# EAGLE design mSD-Shield_v11 (EAGLE 5.11)
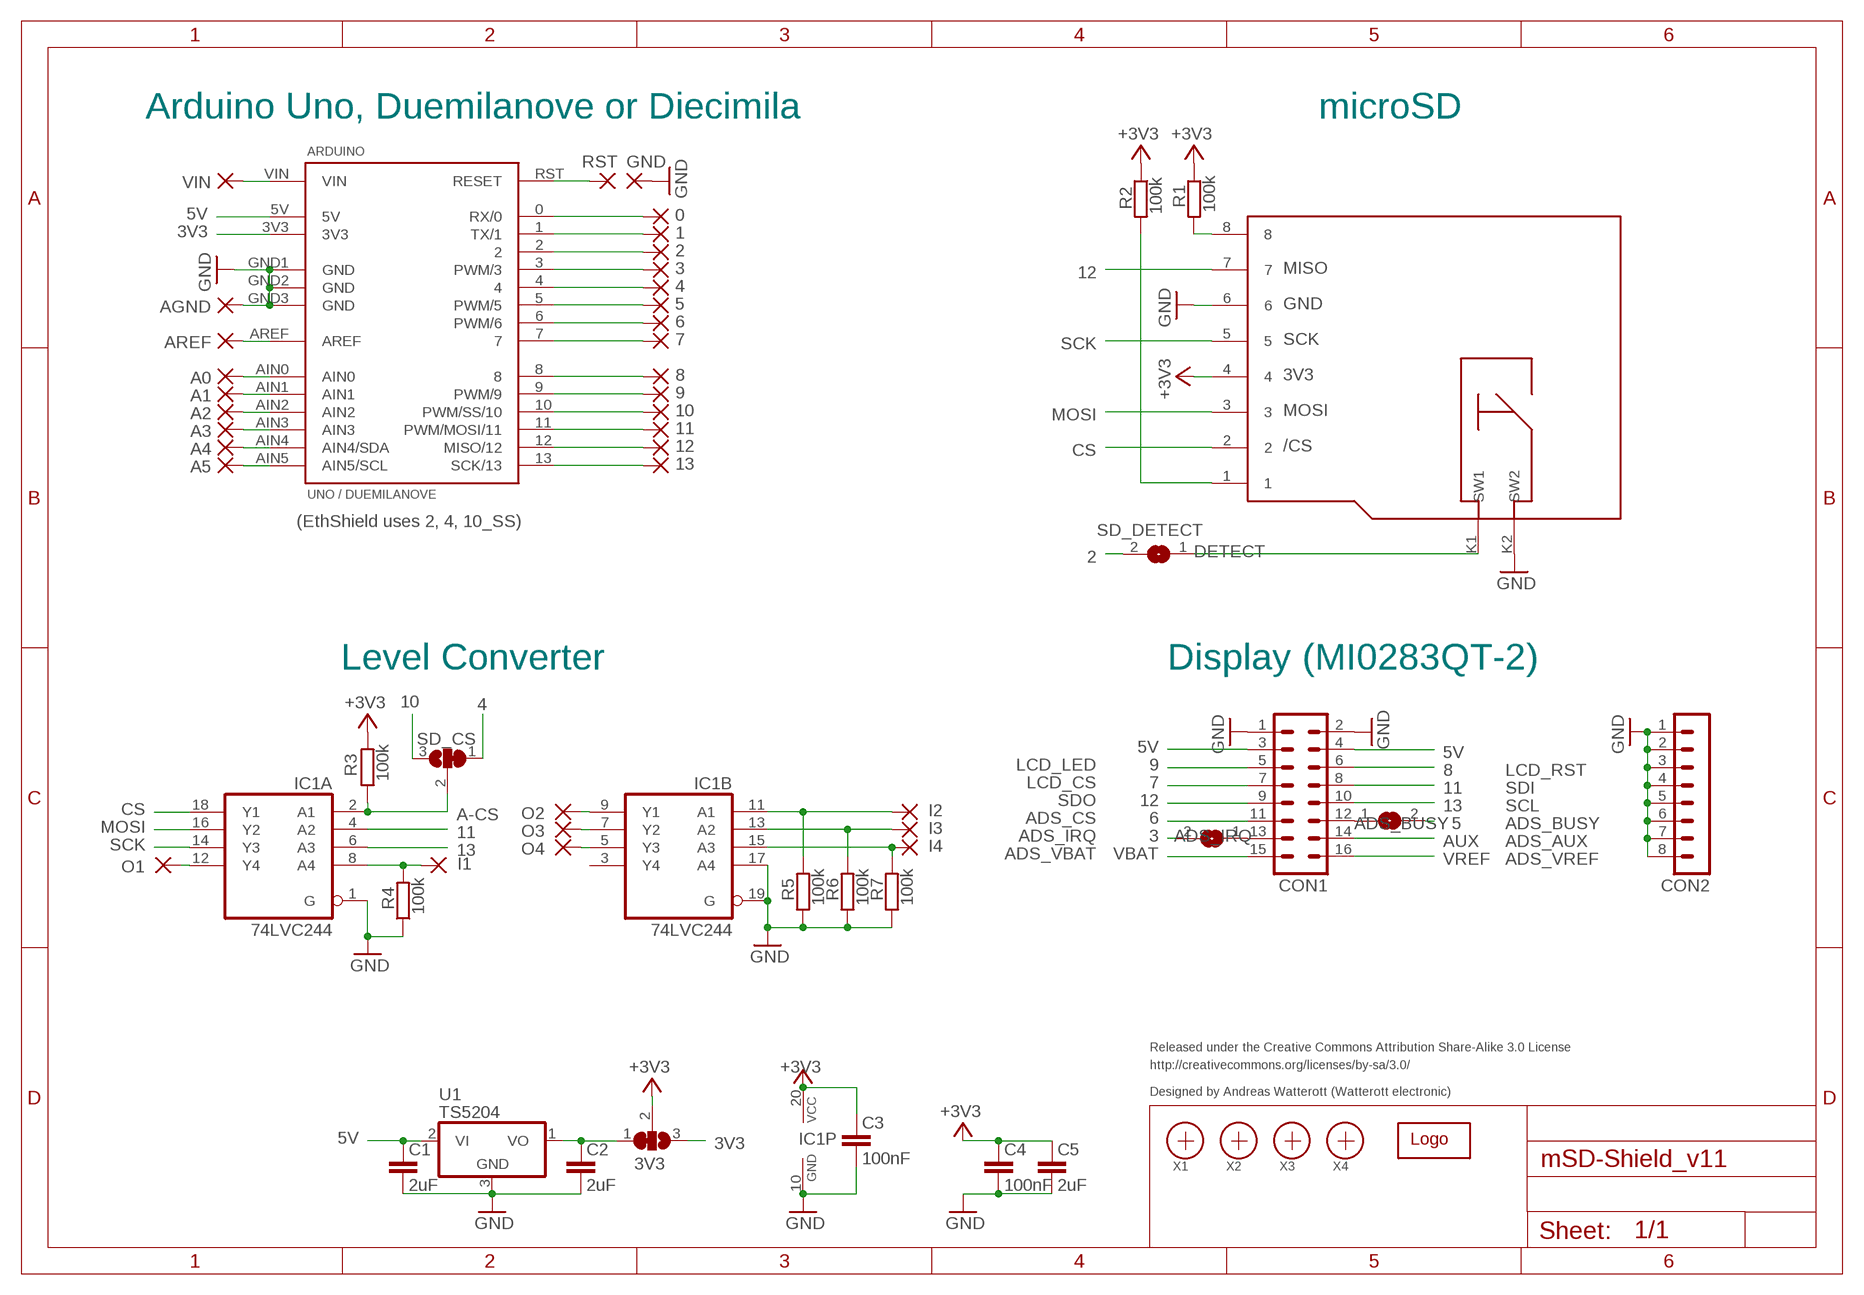
[diagram p0: schematic, sheet 1]

## Parts
0  1,6/0,8  [1,6/0,8]
1  1,6/0,8  [1,6/0,8]
2  1,6/0,8  [1,6/0,8]
3  1,6/0,8  [1,6/0,8]
3V3  SJ2W  [SJ_2]
4  1,6/0,8  [1,6/0,8]
5  1,6/0,8  [1,6/0,8]
6  1,6/0,8  [1,6/0,8]
7  1,6/0,8  [1,6/0,8]
8  1,6/0,8  [1,6/0,8]
9  1,6/0,8  [1,6/0,8]
10  1,6/0,8  [1,6/0,8]
11  1,6/0,8  [1,6/0,8]
12  1,6/0,8  [1,6/0,8]
13  1,6/0,8  [1,6/0,8]
A0  1,6/0,8  [1,6/0,8]
A1  1,6/0,8  [1,6/0,8]
A2  1,6/0,8  [1,6/0,8]
A3  1,6/0,8  [1,6/0,8]
A4  1,6/0,8  [1,6/0,8]
A5  1,6/0,8  [1,6/0,8]
ADS_BUSY  SJ  [SJ]
ADS_IRQ  SJ  [SJ]
AGND  1,6/0,8  [1,6/0,8]
ARDUINO  UNO / DUEMILANOVE  DUEMILANOVE2  [DUEMILANOVE2]
AREF  1,6/0,8  [1,6/0,8]
C1  2uF  C-EUC0805  [C0805]
C2  2uF  C-EUC0805  [C0805]
C3  100nF  C-EUC0603  [C0603]
C4  100nF  C-EUC0603  [C0603]
C5  2uF  C-EUC0603  [C0603]
CON1  MA08-2  [MA08-2]
CON2  MA08-1  [MA08-1]
GND  SMD2  [SMD1,27-2,54]
I1  SMD2  [SMD1,27-2,54]
I2  SMD2  [SMD1,27-2,54]
I3  SMD2  [SMD1,27-2,54]
I4  SMD2  [SMD1,27-2,54]
IC1  74LVC244  74HC244DW  [SO20W]
O1  SMD2  [SMD1,27-2,54]
O2  SMD2  [SMD1,27-2,54]
O3  SMD2  [SMD1,27-2,54]
O4  SMD2  [SMD1,27-2,54]
R1  100k  R-EU_R0603  [R0603]
R2  100k  R-EU_R0603  [R0603]
R3  100k  R-EU_R0603  [R0603]
R4  100k  R-EU_R0603  [R0603]
R5  100k  R-EU_R0603  [R0603]
R6  100k  R-EU_R0603  [R0603]
R7  100k  R-EU_R0603  [R0603]
RST  SMD2  [SMD1,27-2,54]
SD_CS  SJ2W  [SJ_2]
SD_DETECT  SJ  [SJ]
U1  TS5204  [SOT23]
U$1  WE-LOGO  [WE-LOGO]
VIN  1,6/0,8  [1,6/0,8]
X1  PASSER  [PASSER]
X2  PASSER  [PASSER]
X3  PASSER  [PASSER]
X4  PASSER  [PASSER]
X5  MICRO-SD  [MICRO-SD]

## Nets
0: 0.1(P) ARDUINO.0(RX/0)
1: 1.1(P) ARDUINO.1(TX/1)
2: 2.1(P) ARDUINO.2 SD_DETECT.2
3: 3.1(P) ADS_IRQ.2 ARDUINO.3(PWM/3)
3V3: 3V3.3 ARDUINO.3V3
3V_OUT: 3V3.1 C2.1 U1.1(VO)
4: 4.1(P) ARDUINO.4 SD_CS.1
5: 5.1(P) ADS_BUSY.2 ARDUINO.5(PWM/5)
5V: ARDUINO.5V C1.1 CON1.3 CON1.4 U1.2(VI)
6: 6.1(P) ARDUINO.6(PWM/6) CON1.11
7: 7.1(P) ARDUINO.7 CON1.7
8: 8.1(P) ARDUINO.8 CON1.6
9: 9.1(P) ARDUINO.9(PWM/9) CON1.5
10: 10.1(P) ARDUINO.10(PWM/SS/10) SD_CS.3
11: 11.1(P) ARDUINO.11(PWM/MOSI/11) CON1.8 IC1.4(A:A2)
12: 12.1(P) ARDUINO.12(MISO/12) CON1.9 X5.7
13: 13.1(P) ARDUINO.13(SCK/13) CON1.10 IC1.6(A:A3)
+3V3: 3V3.2 C3.1 C4.1 C5.1 IC1.20(P:VCC) R1.1 R2.1 R3.2 X5.4
A-CS: IC1.2(A:A1) R3.1 SD_CS.2
ADS_BUSY: ADS_BUSY.1 CON1.12
ADS_IRQ: ADS_IRQ.1 CON1.13
AIN0: A0.1(P) ARDUINO.AIN0
AIN1: A1.1(P) ARDUINO.AIN1
AIN2: A2.1(P) ARDUINO.AIN2
AIN3: A3.1(P) ARDUINO.AIN3
AIN4: A4.1(P) ARDUINO.AIN4(AIN4/SDA)
AIN5: A5.1(P) ARDUINO.AIN5(AIN5/SCL)
AUX: CON1.14
CS: IC1.18(A:Y1) X5.2
DETECT: SD_DETECT.1 X5.K1(SW1)
GND: AGND.1(P) ARDUINO.GND1(GND) ARDUINO.GND2(GND) ARDUINO.GND3(GND) C1.2 C2.2 C3.2 C4.2 C5.2 CON1.1 CON1.2 CON2.1 CON2.2 CON2.3 CON2.4 CON2.5 CON2.6 CON2.7 CON2.8 GND.1(P) IC1.1(A:G) IC1.10(P:GND) IC1.17(B:A4) IC1.19(B:G) R4.1 R5.1 R6.1 R7.1 U1.3(GND) X5.6 X5.K2(SW2)
I-1: I1.1(P) IC1.8(A:A4) R4.2
I-2: I2.1(P) IC1.11(B:A1) R5.2
I-3: I3.1(P) IC1.13(B:A2) R6.2
I-4: I4.1(P) IC1.15(B:A3) R7.2
MOSI: IC1.16(A:Y2) X5.3
N$16: R2.2 X5.1
N$17: R1.2 X5.8
N$18: ARDUINO.VIN VIN.1(P)
N$197: ARDUINO.AREF AREF.1(P)
O-1: IC1.12(A:Y4) O1.1(P)
O-2: IC1.9(B:Y1) O2.1(P)
O-3: IC1.7(B:Y2) O3.1(P)
O-4: IC1.5(B:Y3) O4.1(P)
RST: ARDUINO.RST(RESET) RST.1(P)
SCK: IC1.14(A:Y3) X5.5
VBAT: CON1.15
VREF: CON1.16
Unconnected: IC1.3(B:Y4)

## Notes on the sheet
- Arduino Uno, Duemilanove or Diecimila | microSD
- (EthShield uses 2, 4, 10_SS)
- Level Converter | Display (MI0283QT-2)
- LCD_LED
- LCD_CS | LCD_RST
- SDO | SDI
- ADS_CS | SCL
- ADS_IRQ | ADS_BUSY
- ADS_VBAT | ADS_AUX
- ADS_VREF
- Released under the Creative Commons Attribution Share-Alike 3.0 License
- http://creativecommons.org/licenses/by-sa/3.0/
- Designed by Andreas Watterott (Watterott electronic)

## Library data of the parts
0 1-13 A0 A1-A5 AGND AREF VIN = wirepad:1,6/0,8: THROUGH-HOLE PAD
3V3 SD_CS = jumper:SJ2W: SMD solder JUMPER
ADS_BUSY ADS_IRQ SD_DETECT = jumper:SJ: SMD solder JUMPER
ARDUINO = Arduino:DUEMILANOVE: Arduino Duemilanove
C1-C5 = rcl:C-EU: CAPACITOR, European symbol
CON1 = con-lstb:MA08-2: PIN HEADER
CON2 = con-lstb:MA08-1: PIN HEADER
GND I1-I4 O1-O4 RST = wirepad:SMD2: SMD PAD
IC1 = 74xx-eu:74*244: Octal BUFFER and LINE DRIVER, 3-state
R1-R7 = rcl:R-EU_: RESISTOR, European symbol
U1 = Voltage-Reg:TS5204
U$1 = welectronic:WE-LOGO
X1-X4 = SMD:PASSER
X5 = SD-Card:MICRO-SD

## Board
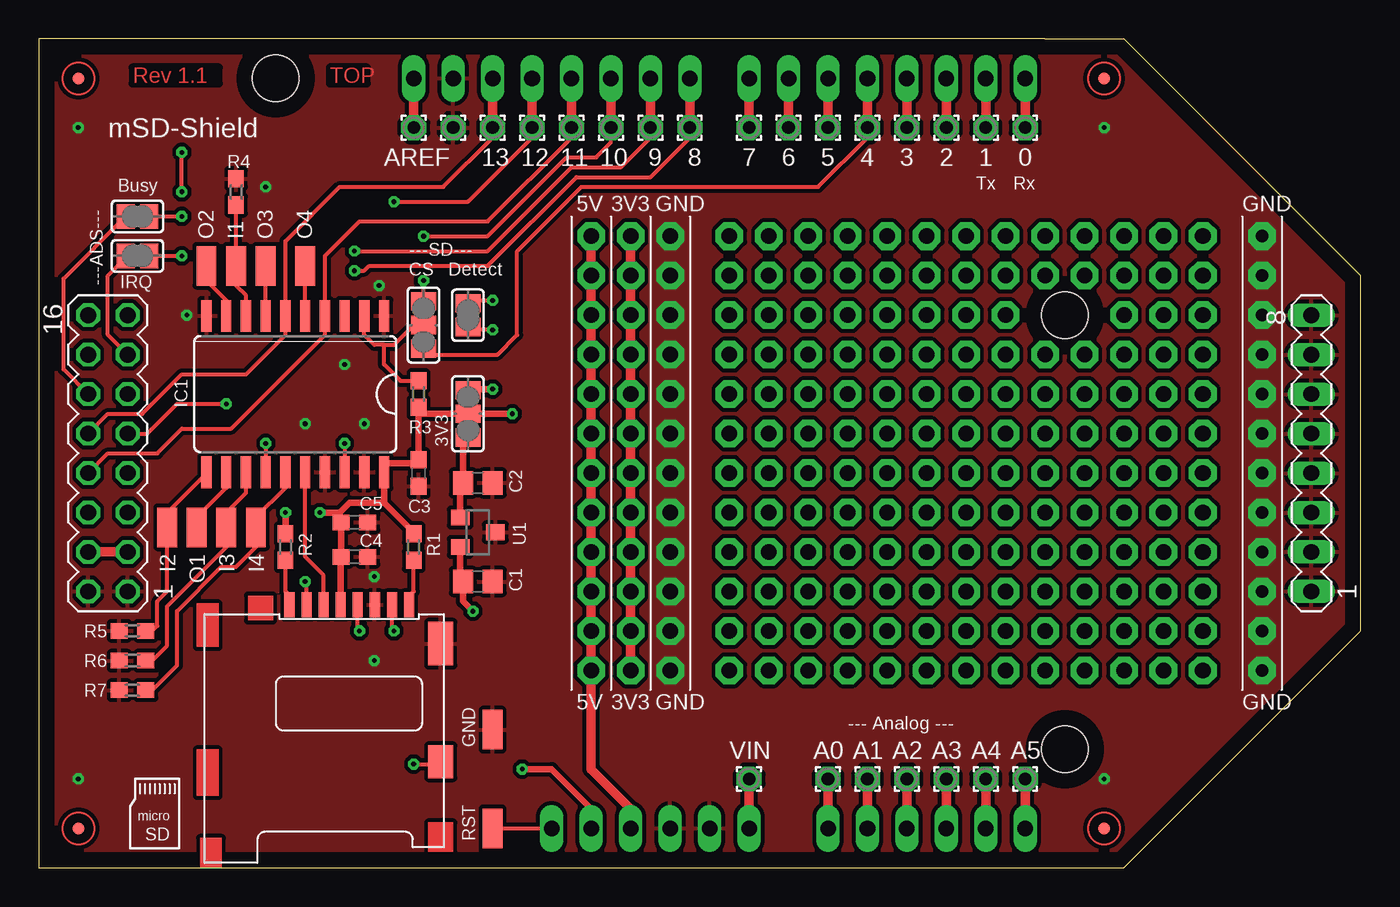
[diagram p1: board, top side]
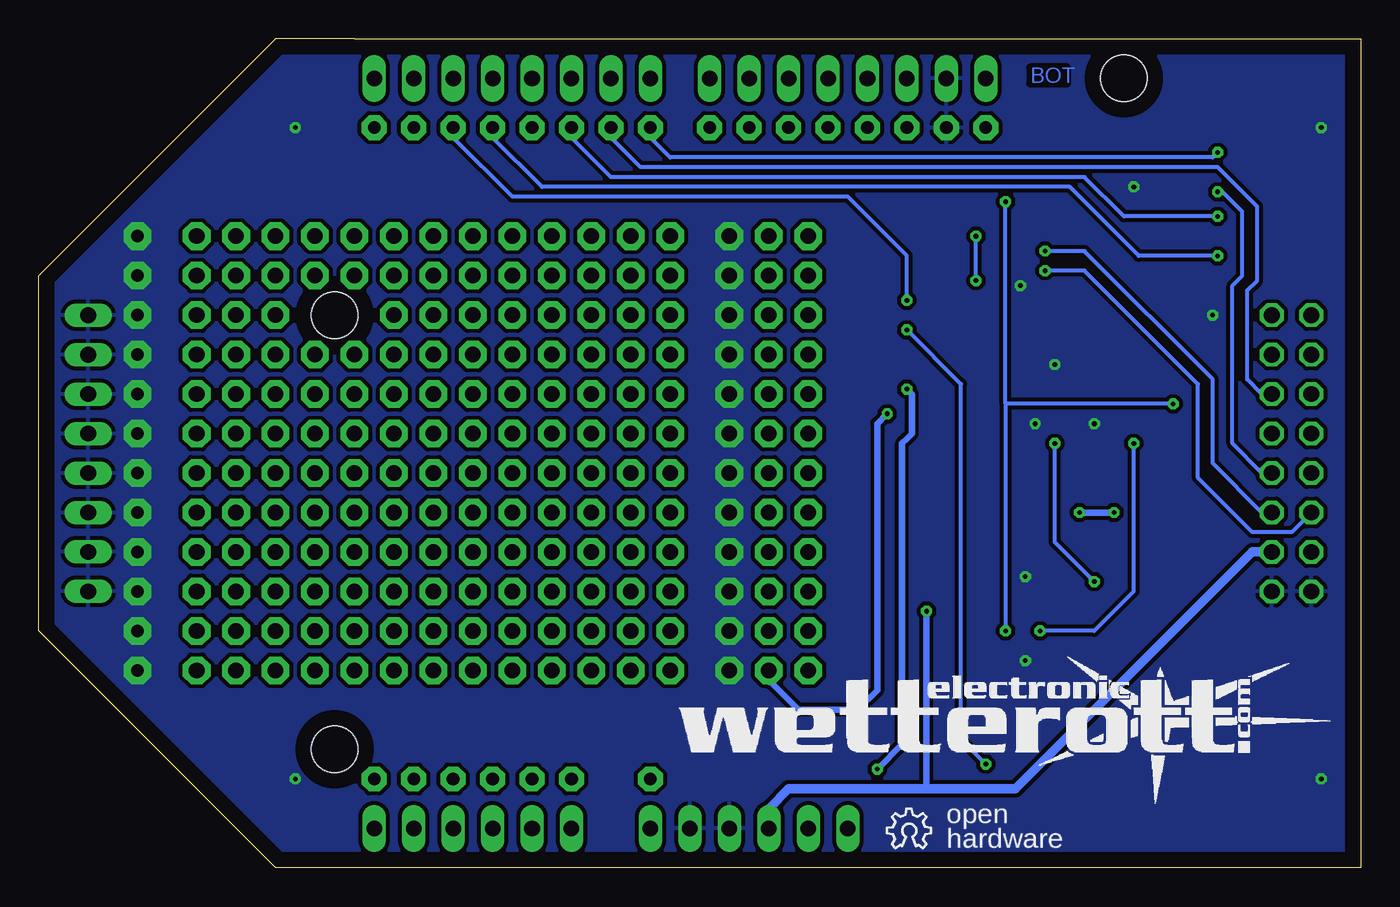
[diagram p2: board, bottom side, seen from below]

Size 85.09 x 53.34 mm. Coordinates in mm from the lower left corner, seen from the top.
Outline: 64.77,53.34 69.85,53.34 85.09,38.1 85.09,15.24 69.85,0 66.04,0
Copper layers (1*16): Top 0.035mm / dielectric 1.5mm / Bottom 0.035mm
Design rules "default *": minimum track width 10mil, minimum drill 0.3mm, track to track 8mil, track to pad 8mil, pad to pad 8mil, via to via 8mil, smd to smd 8mil, copper to edge 40mil, drill to drill 8mil, minimum pad ring 10mil, minimum via ring 8mil, stop-mask expansion 4mil, vias tented up to drill 0.5mm, thermal gap 10mil

### Footprints (pad centres in the part's own frame; a part is rotated, then mirrored left to right if it is on the bottom)
1,6/0,8 = drill 0.813 pad 1.6 octagon: 1 0,0
SJ_2 = smd 1.168 x 1.6: 1 -1.524,0; 2 0,0; 3 1.524,0
SJ = smd 1.168 x 1.6: 1 -0.762,0; 2 0.762,0
DUEMILANOVE2 = drill 1 long: 0 63.5,50.8; 1 60.96,50.8; 2 58.42,50.8; 3 55.88,50.8; 3V3 35.56,2.54; 4 53.34,50.8; 5 50.8,50.8; 5V 38.1,2.54; 6 48.26,50.8; 7 45.72,50.8; 8 41.91,50.8; 9 39.37,50.8; 10 36.83,50.8; 11 34.29,50.8; 12 31.75,50.8; 13 29.21,50.8; AIN0 50.8,2.54; AIN1 53.34,2.54; AIN2 55.88,2.54; AIN3 58.42,2.54; AIN4 60.96,2.54; AIN5 63.5,2.54; AREF 24.13,50.8; GND1 40.64,2.54; GND2 43.18,2.54; GND3 26.67,50.8; RST 33.02,2.54; VIN 45.72,2.54 | hole 3: 66.04,35.56; 66.04,7.62; 15.24,50.8
C0805 = smd 1.3 x 1.5: 1 -0.95,0; 2 0.95,0
C0603 = smd 1.1 x 1: 1 -0.85,0; 2 0.85,0
MA08-2 = drill 1.016 octagon: 1 -8.89,-1.27; 2 -8.89,1.27; 3 -6.35,-1.27; 4 -6.35,1.27; 5 -3.81,-1.27; 6 -3.81,1.27; 7 -1.27,-1.27; 8 -1.27,1.27; 9 1.27,-1.27; 10 1.27,1.27; 11 3.81,-1.27; 12 3.81,1.27; 13 6.35,-1.27; 14 6.35,1.27; 15 8.89,-1.27; 16 8.89,1.27
MA08-1 = drill 1.016 long: 1 -8.89,0; 2 -6.35,0; 3 -3.81,0; 4 -1.27,0; 5 1.27,0; 6 3.81,0; 7 6.35,0; 8 8.89,0
SMD1,27-2,54 = smd 1.27 x 2.54: 1 0,0
SO20W = smd 0.66 x 2.032: 1 -5.715,-5.029; 2 -4.445,-5.029; 3 -3.175,-5.029; 4 -1.905,-5.029; 5 -0.635,-5.029; 6 0.635,-5.029; 7 1.905,-5.029; 8 3.175,-5.029; 9 4.445,-5.029; 10 5.715,-5.029; 11 5.715,5.029; 12 4.445,5.029; 13 3.175,5.029; 14 1.905,5.029; 15 0.635,5.029; 16 -0.635,5.029; 17 -1.905,5.029; 18 -3.175,5.029; 19 -4.445,5.029; 20 -5.715,5.029
R0603 = smd 1.1 x 1: 1 -0.85,0; 2 0.85,0
SOT23 = smd 1 x 1.2: 1 -0.95,-1.132; 2 0.95,-1.132; 3 0,1.132
PASSER = smd 0.762 x 0.762: X 0,0
MICRO-SD = smd 0.65 x 1.6: 1 -10.54,16.6; 2 -9.44,16.6; 3 -8.34,16.6; 4 -7.24,16.6; 5 -6.14,16.6; 6 -5.04,16.6; 7 -3.94,16.6; 8 -2.84,16.6 | smd 1.6 x 2.1: K1 -0.8,6.5 | smd 1.6 x 2.8: K2 -0.8,14.1

### Placement (x,y rotation side)
0  63.5,47.62 0 top
1  60.96,47.62 0 top
2  58.42,47.62 0 top
3  55.88,47.62 0 top
3V3  27.62,29.21 90 top
4  53.34,47.62 0 top
5  50.8,47.62 0 top
6  48.26,47.62 0 top
7  45.72,47.62 0 top
8  41.91,47.62 0 top
9  39.37,47.62 0 top
10  36.83,47.62 0 top
11  34.29,47.62 0 top
12  31.75,47.62 0 top
13  29.21,47.62 0 top
A0  50.8,5.71 180 top
A1  53.34,5.71 180 top
A2  55.88,5.71 180 top
A3  58.42,5.71 180 top
A4  60.96,5.71 180 top
A5  63.5,5.71 180 top
ADS_BUSY  6.35,41.91 0 top
ADS_IRQ  6.35,39.37 0 top
AGND  26.67,47.62 0 top
ARDUINO  0,0 0 top
AREF  24.13,47.62 0 top
C1  28.26,18.41 0 top
C2  28.26,24.77 0 top
C3  24.45,25.4 270 top
C4  20.32,20 0 top
C5  20.32,22.23 0 top
CON1  4.45,26.67 90 top
CON2  81.92,26.67 90 top
GND  29.21,8.89 0 top
I1  12.7,38.73 0 top
I2  8.26,21.91 0 top
I3  12.06,21.91 0 top
I4  13.97,21.91 0 top
IC1  16.51,30.48 180 top
LOGO1  OSHW_LOGO_6MILX0100-NT  [OSHW_6X100_NOTEXT]  30.48,1.27 0 bottom
O1  10.16,21.91 0 top
O2  10.79,38.73 0 top
O3  14.61,38.73 0 top
O4  17.14,38.73 0 top
R1  24.13,20.64 270 top
R2  15.88,20.64 270 top
R3  24.45,30.48 270 top
R4  12.7,43.5 270 top
R5  6.03,15.24 0 top
R6  6.03,13.34 0 top
R7  6.03,11.43 0 top
RST  29.21,2.54 0 top
SD_CS  24.77,34.92 90 top
SD_DETECT  27.62,35.56 90 top
U1  28.26,21.59 270 top
U$1  44.13,3.81 0 bottom
VIN  45.72,5.71 0 top
X1  2.54,2.54 0 top
X2  2.54,50.8 0 top
X3  68.58,50.8 0 top
X4  68.58,2.54 0 top
X5  26.67,0.32 0 top

### Tracks (layer width: path | path; a pad name or v marks a point on that pad's centre or on a via)
0
  Top 0.61: 0.1 ARDUINO.0
1
  Top 0.61: 1.1 ARDUINO.1
2  (via drill 0.3)
  Top 0.254: v29.21,36.51 27.81,36.51 SD_DETECT.2
  Top 0.61: 2.1 ARDUINO.2
  Bottom 0.254: 2.1 58.42,46.99 54.61,43.18 33.02,43.18 29.21,39.37 v29.21,36.51
3  (via drill 0.3)
  Top 0.254: ADS_IRQ.2 v9.21,39.37
  Top 0.61: 3.1 ARDUINO.3
  Bottom 0.254: 3.1 55.88,46.99 52.7,43.81 18.73,43.81 14.29,39.37 v9.21,39.37
3V3  (via drill 0.3)
  Top 0.254: 27.69,30.8 3V3.3
  Top 0.406: ARDUINO.3V3 35.56,3.81 33.02,6.35 v31.11,6.35 | v29.21,30.8 27.69,30.8
  Bottom 0.406: v31.11,6.35 29.53,7.94 29.53,27.3 29.21,27.62 28.89,27.94 28.89,30.48 v29.21,30.8
3V_OUT
  Top 0.254: 27.13,24.58 C2.1 | 27.31,27.37 3V3.1
  Top 0.406: U1.1 27.13,24.58 | C2.1 27.31,27.37
4
  Top 0.254: SD_CS.1 24.77,33.02 29.53,33.02 30.8,34.29 30.8,39.69 34.92,43.81 50.16,43.81 53.34,46.99 4.1
  Top 0.61: 4.1 ARDUINO.4
5  (via drill 0.3)
  Top 0.254: ADS_BUSY.2 v9.21,41.91
  Top 0.61: 5.1 ARDUINO.5
  Bottom 0.254: 5.1 50.8,46.99 48.26,44.45 17.78,44.45 15.24,41.91 v9.21,41.91
5V  (via drill 0.3, 1 pad 1.78)
  Top 0.254: C1.1 27.13,18.6
  Top 0.406: 27.13,18.6 U1.2 | C1.1 27.31,17.14 v27.94,16.51
  Top 0.61: CON1.4 CON1.3 | v35.56,40.64 v35.56,38.1 v35.56,35.56 v35.56,33.02 v35.56,30.48 v35.56,27.94 v35.56,25.4 v35.56,22.86 v35.56,20.32 v35.56,17.78 v35.56,15.24 v35.56,12.7 35.56,6.35 38.1,3.81 ARDUINO.5V
  Bottom 0.406: 27.94,5.08 v27.94,16.51
  Bottom 0.61: CON1.3 6.99,20.32 22.23,5.08 27.94,5.08 36.83,5.08 38.1,3.81 ARDUINO.5V
6
  Top 0.61: 6.1 ARDUINO.6
  Bottom 0.254: CON1.11 6.35,30.48 7.3,31.43 7.3,37.15 6.67,37.78 6.67,42.55 9.21,45.09 46.35,45.09 48.26,46.99 6.1
7  (via drill 0.3)
  Top 0.254: v9.21,43.5 v9.21,46.04
  Top 0.61: 7.1 ARDUINO.7
  Bottom 0.254: 7.1 45.72,46.99 44.45,45.72 9.53,45.72 v9.21,46.04 | CON1.7 6.35,25.4 8.26,27.3 8.26,37.47 7.62,38.1 7.62,42.23 8.89,43.5 v9.21,43.5
8  (via drill 0.3)
  Top 0.254: 8.1 41.91,46.99 39.37,44.45 34.61,44.45 28.89,38.73 21.27,38.73 20.95,38.42 v20.32,38.42
  Top 0.61: 8.1 ARDUINO.8
  Bottom 0.254: CON1.6 4.45,21.59 6.99,21.59 10.48,25.08 10.48,31.11 17.78,38.42 v20.32,38.42
9  (via drill 0.3)
  Top 0.254: 9.1 39.37,46.99 37.47,45.09 34.29,45.09 28.89,39.69 v20.32,39.69
  Top 0.61: 9.1 ARDUINO.9
  Bottom 0.254: CON1.5 6.35,22.86 9.53,26.04 9.53,31.43 17.78,39.69 v20.32,39.69
10  (via drill 0.3)
  Top 0.254: 10.1 36.83,46.67 35.88,45.72 33.97,45.72 28.89,40.64 v24.77,40.64 | SD_CS.3 v24.77,37.78
  Top 0.61: 10.1 ARDUINO.10
  Bottom 0.254: v24.77,37.78 v24.77,40.64
11
  Top 0.254: CON1.8 4.45,26.67 7.62,26.67 9.21,28.26 12.38,28.26 18.41,34.29 IC1.4 18.41,39.37 20.64,41.59 28.89,41.59 34.29,46.99 11.1
  Top 0.61: 11.1 ARDUINO.11
12  (via drill 0.3)
  Top 0.254: X5.7 22.73,15.37 v22.86,15.24 | 12.1 31.75,46.99 27.62,42.86 v22.86,42.86 | CON1.9 6.99,27.94 8.89,29.84 v12.06,29.84
  Top 0.61: 12.1 ARDUINO.12
  Bottom 0.254: 22.86,29.84 v22.86,15.24 | 22.86,29.84 v22.86,42.86 | v12.06,29.84 22.86,29.84
13
  Top 0.254: CON1.10 4.45,29.21 6.67,29.21 9.21,31.75 13.34,31.75 15.88,34.29 IC1.6 15.88,40.32 19.37,43.81 26.04,43.81 29.21,46.99 13.1
  Top 0.61: 13.1 ARDUINO.13
+3V3  (via drill 0.3, 1 pad 1.78)
  Top 0.254: 19.43,19.96 C4.1 | C5.1 19.37,22.23 | 24.45,29.21 R3.2 | IC1.20 22.23,26.04 | 24.23,26.04 C3.1 | 24.13,21.59 R1.1 | 3V3.2 27.62,27.62
  Top 0.406: X5.4 19.43,19.96 | C4.1 C5.1 | v15.88,22.86 R2.1 | 19.37,22.23 19.37,22.86 | 19.37,22.86 20,23.5 22.23,23.5 | 22.23,23.5 IC1.20 | C3.1 24.45,29.21 3V3.2 v30.48,29.21 | 22.23,26.04 24.23,26.04 | 22.23,23.5 24.13,21.59 | 19.37,22.86 v18.1,22.86
  Top 0.61: v38.1,12.7 v38.1,15.24 v38.1,17.78 v38.1,20.32 v38.1,22.86 v38.1,25.4 v38.1,27.94 v38.1,30.48 v38.1,33.02 v38.1,35.56 v38.1,38.1 v38.1,40.64
  Bottom 0.406: v18.1,22.86 v15.88,22.86 | v30.48,29.21 31.11,28.57 31.11,11.43 32.38,10.16 36.2,10.16 38.1,12.06
  Bottom 0.61: 38.1,12.06 v38.1,12.7
A-CS
  Top 0.254: 22.23,33.66 21.59,33.66 20.95,34.29 IC1.2 | 22.23,33.66 22.86,33.66 24.13,34.92 SD_CS.2 24.77,33.34 | R3.1 23.28,31.33 22.23,32.38 22.23,33.66
ADS_BUSY
  Top 0.254: CON1.12 1.59,32.07 1.59,37.91 ADS_BUSY.1
ADS_IRQ
  Top 0.254: CON1.13 4.45,34.29 4.45,38.1 5.4,39.05 5.4,39.18 ADS_IRQ.1
AIN0
  Top 0.61: ARDUINO.AIN0 A0.1
AIN1
  Top 0.61: ARDUINO.AIN1 A1.1
AIN2
  Top 0.61: ARDUINO.AIN2 A2.1
AIN3
  Top 0.61: ARDUINO.AIN3 A3.1
AIN4
  Top 0.61: ARDUINO.AIN4 A4.1
AIN5
  Top 0.61: ARDUINO.AIN5 A5.1
CS  (via drill 0.3)
  Top 0.254: v19.68,27.3 IC1.18 | X5.2 17.23,18.33 v17.14,18.41
  Bottom 0.254: v17.14,18.41 19.68,20.95 v19.68,27.3
DETECT  (via drill 0.3)
  Top 0.254: SD_DETECT.1 27.62,34.61 v29.21,34.61 | v24.13,6.67 25.7,6.67 X5.K1
  Bottom 0.254: v29.21,34.61 25.72,31.11 25.72,8.26 v24.13,6.67
GND  (via drill 0.3, 0.8 pad 1.78, 1 pad 1.78)
  other vias: 21.59,18.73 40.64,40.64 40.64,38.1 40.64,35.56 40.64,33.02 40.64,12.7 40.64,15.24 40.64,17.78 40.64,20.32 40.64,22.86 40.64,25.4 40.64,27.94 40.64,30.48 19.68,32.38 21.91,37.47 9.53,35.56 17.14,28.57 20.95,28.57 21.59,13.34 2.54,47.62 14.61,43.81 68.58,47.62 2.54,5.71 68.58,5.71 78.74,40.64 78.74,38.1 78.74,35.56 78.74,33.02 78.74,12.7 78.74,15.24 78.74,17.78 78.74,20.32 78.74,22.86 78.74,25.4 78.74,27.94 78.74,30.48
  pour Bottom (isolate 0.254): 0,53.34 85.09,53.34 85.09,0 0,0
  pour Top (isolate 0.254): 0,0 0,53.34 85.09,53.34 85.09,0
I-1
  Top 0.254: IC1.8 13.34,36.83 12.7,37.47 I1.1 R4.2
I-2
  Top 0.254: IC1.11 10.79,25.4 8.26,22.86 I2.1 8.26,17.78 7.62,17.14 7.62,15.56 7.3,15.24 R5.2
I-3
  Top 0.254: IC1.13 13.34,24.13 12.06,22.86 I3.1 12.06,20.64 8.26,16.83 8.26,14.29 7.3,13.34 R6.2
I-4
  Top 0.254: IC1.15 15.88,24.45 13.97,22.54 I4.1 13.97,20.64 12.7,19.37 11.75,19.37 8.89,16.51 8.89,13.02 7.3,11.43 R7.2
MOSI
  Top 0.254: X5.3 18.33,18.82 17.14,20 IC1.16
N$1  (via drill 1 pad 1.78)
  other vias: 64.77,38.1
N$2  (via drill 1 pad 1.78)
  other vias: 67.31,38.1
N$3  (via drill 1 pad 1.78)
  other vias: 74.93,38.1
N$4  (via drill 1 pad 1.78)
  other vias: 72.39,38.1
N$5  (via drill 1 pad 1.78)
  other vias: 69.85,38.1
N$6  (via drill 1 pad 1.78)
  other vias: 64.77,33.02
N$7  (via drill 1 pad 1.78)
  other vias: 67.31,33.02
N$8  (via drill 1 pad 1.78)
  other vias: 62.23,38.1
N$9  (via drill 1 pad 1.78)
  other vias: 59.69,38.1
N$10  (via drill 1 pad 1.78)
  other vias: 57.15,38.1
N$11  (via drill 1 pad 1.78)
  other vias: 54.61,38.1
N$12  (via drill 1 pad 1.78)
  other vias: 52.07,38.1
N$13  (via drill 1 pad 1.78)
  other vias: 49.53,38.1
N$14  (via drill 1 pad 1.78)
  other vias: 46.99,38.1
N$15  (via drill 1 pad 1.78)
  other vias: 44.45,38.1
N$16
  Top 0.254: X5.1 16.13,17.52 15.88,17.78 R2.2
N$17
  Top 0.254: X5.8 23.83,17.48 24.13,17.78 R1.2
N$18
  Top 0.61: ARDUINO.VIN VIN.1
N$21  (via drill 1 pad 1.78)
  other vias: 74.93,40.64
N$22  (via drill 1 pad 1.78)
  other vias: 72.39,40.64
N$23  (via drill 1 pad 1.78)
  other vias: 69.85,40.64
N$24  (via drill 1 pad 1.78)
  other vias: 67.31,40.64
N$25  (via drill 1 pad 1.78)
  other vias: 64.77,40.64
N$26  (via drill 1 pad 1.78)
  other vias: 62.23,40.64
N$27  (via drill 1 pad 1.78)
  other vias: 59.69,40.64
N$28  (via drill 1 pad 1.78)
  other vias: 57.15,40.64
N$29  (via drill 1 pad 1.78)
  other vias: 54.61,40.64
N$30  (via drill 1 pad 1.78)
  other vias: 52.07,40.64
N$31  (via drill 1 pad 1.78)
  other vias: 49.53,40.64
N$32  (via drill 1 pad 1.78)
  other vias: 46.99,40.64
N$33  (via drill 1 pad 1.78)
  other vias: 44.45,40.64
N$37  (via drill 1 pad 1.78)
  other vias: 74.93,12.7
N$38  (via drill 1 pad 1.78)
  other vias: 72.39,12.7
N$39  (via drill 1 pad 1.78)
  other vias: 69.85,12.7
N$40  (via drill 1 pad 1.78)
  other vias: 67.31,12.7
N$41  (via drill 1 pad 1.78)
  other vias: 64.77,12.7
N$42  (via drill 1 pad 1.78)
  other vias: 62.23,12.7
N$43  (via drill 1 pad 1.78)
  other vias: 59.69,12.7
N$44  (via drill 1 pad 1.78)
  other vias: 57.15,12.7
N$45  (via drill 1 pad 1.78)
  other vias: 54.61,12.7
N$46  (via drill 1 pad 1.78)
  other vias: 52.07,12.7
N$47  (via drill 1 pad 1.78)
  other vias: 49.53,12.7
N$48  (via drill 1 pad 1.78)
  other vias: 46.99,12.7
N$49  (via drill 1 pad 1.78)
  other vias: 44.45,12.7
N$53  (via drill 1 pad 1.78)
  other vias: 74.93,35.56
N$54  (via drill 1 pad 1.78)
  other vias: 72.39,35.56
N$55  (via drill 1 pad 1.78)
  other vias: 69.85,35.56
N$58  (via drill 1 pad 1.78)
  other vias: 62.23,35.56
N$59  (via drill 1 pad 1.78)
  other vias: 59.69,35.56
N$60  (via drill 1 pad 1.78)
  other vias: 57.15,35.56
N$61  (via drill 1 pad 1.78)
  other vias: 54.61,35.56
N$62  (via drill 1 pad 1.78)
  other vias: 52.07,35.56
N$63  (via drill 1 pad 1.78)
  other vias: 49.53,35.56
N$64  (via drill 1 pad 1.78)
  other vias: 46.99,35.56
N$65  (via drill 1 pad 1.78)
  other vias: 44.45,35.56
N$69  (via drill 1 pad 1.78)
  other vias: 74.93,33.02
N$70  (via drill 1 pad 1.78)
  other vias: 72.39,33.02
N$71  (via drill 1 pad 1.78)
  other vias: 69.85,33.02
N$74  (via drill 1 pad 1.78)
  other vias: 62.23,33.02
N$75  (via drill 1 pad 1.78)
  other vias: 59.69,33.02
N$76  (via drill 1 pad 1.78)
  other vias: 57.15,33.02
N$77  (via drill 1 pad 1.78)
  other vias: 54.61,33.02
N$78  (via drill 1 pad 1.78)
  other vias: 52.07,33.02
N$79  (via drill 1 pad 1.78)
  other vias: 49.53,33.02
N$80  (via drill 1 pad 1.78)
  other vias: 46.99,33.02
N$81  (via drill 1 pad 1.78)
  other vias: 44.45,33.02
N$85  (via drill 1 pad 1.78)
  other vias: 74.93,30.48
N$86  (via drill 1 pad 1.78)
  other vias: 72.39,30.48
N$87  (via drill 1 pad 1.78)
  other vias: 69.85,30.48
N$88  (via drill 1 pad 1.78)
  other vias: 67.31,30.48
N$89  (via drill 1 pad 1.78)
  other vias: 64.77,30.48
N$90  (via drill 1 pad 1.78)
  other vias: 62.23,30.48
N$91  (via drill 1 pad 1.78)
  other vias: 59.69,30.48
N$92  (via drill 1 pad 1.78)
  other vias: 57.15,30.48
N$93  (via drill 1 pad 1.78)
  other vias: 54.61,30.48
N$94  (via drill 1 pad 1.78)
  other vias: 52.07,30.48
N$95  (via drill 1 pad 1.78)
  other vias: 49.53,30.48
N$96  (via drill 1 pad 1.78)
  other vias: 46.99,30.48
N$97  (via drill 1 pad 1.78)
  other vias: 44.45,30.48
N$101  (via drill 1 pad 1.78)
  other vias: 74.93,27.94
N$102  (via drill 1 pad 1.78)
  other vias: 72.39,27.94
N$103  (via drill 1 pad 1.78)
  other vias: 69.85,27.94
N$104  (via drill 1 pad 1.78)
  other vias: 67.31,27.94
N$105  (via drill 1 pad 1.78)
  other vias: 64.77,27.94
N$106  (via drill 1 pad 1.78)
  other vias: 62.23,27.94
N$107  (via drill 1 pad 1.78)
  other vias: 59.69,27.94
N$108  (via drill 1 pad 1.78)
  other vias: 57.15,27.94
N$109  (via drill 1 pad 1.78)
  other vias: 54.61,27.94
N$110  (via drill 1 pad 1.78)
  other vias: 52.07,27.94
N$111  (via drill 1 pad 1.78)
  other vias: 49.53,27.94
N$112  (via drill 1 pad 1.78)
  other vias: 46.99,27.94
N$113  (via drill 1 pad 1.78)
  other vias: 44.45,27.94
N$117  (via drill 1 pad 1.78)
  other vias: 74.93,25.4
N$118  (via drill 1 pad 1.78)
  other vias: 72.39,25.4
N$119  (via drill 1 pad 1.78)
  other vias: 69.85,25.4
N$120  (via drill 1 pad 1.78)
  other vias: 67.31,25.4
N$121  (via drill 1 pad 1.78)
  other vias: 64.77,25.4
N$122  (via drill 1 pad 1.78)
  other vias: 62.23,25.4
N$123  (via drill 1 pad 1.78)
  other vias: 59.69,25.4
N$124  (via drill 1 pad 1.78)
  other vias: 57.15,25.4
N$125  (via drill 1 pad 1.78)
  other vias: 54.61,25.4
N$126  (via drill 1 pad 1.78)
  other vias: 52.07,25.4
N$127  (via drill 1 pad 1.78)
  other vias: 49.53,25.4
N$128  (via drill 1 pad 1.78)
  other vias: 46.99,25.4
N$129  (via drill 1 pad 1.78)
  other vias: 44.45,25.4
N$133  (via drill 1 pad 1.78)
  other vias: 74.93,22.86
N$134  (via drill 1 pad 1.78)
  other vias: 72.39,22.86
N$135  (via drill 1 pad 1.78)
  other vias: 69.85,22.86
N$136  (via drill 1 pad 1.78)
  other vias: 67.31,22.86
N$137  (via drill 1 pad 1.78)
  other vias: 64.77,22.86
N$138  (via drill 1 pad 1.78)
  other vias: 62.23,22.86
N$139  (via drill 1 pad 1.78)
  other vias: 59.69,22.86
N$140  (via drill 1 pad 1.78)
  other vias: 57.15,22.86
N$141  (via drill 1 pad 1.78)
  other vias: 54.61,22.86
N$142  (via drill 1 pad 1.78)
  other vias: 52.07,22.86
N$143  (via drill 1 pad 1.78)
  other vias: 49.53,22.86
N$144  (via drill 1 pad 1.78)
  other vias: 46.99,22.86
N$145  (via drill 1 pad 1.78)
  other vias: 44.45,22.86
N$149  (via drill 1 pad 1.78)
  other vias: 74.93,20.32
N$150  (via drill 1 pad 1.78)
  other vias: 72.39,20.32
N$151  (via drill 1 pad 1.78)
  other vias: 69.85,20.32
N$152  (via drill 1 pad 1.78)
  other vias: 67.31,20.32
N$153  (via drill 1 pad 1.78)
  other vias: 64.77,20.32
N$154  (via drill 1 pad 1.78)
  other vias: 62.23,20.32
N$155  (via drill 1 pad 1.78)
  other vias: 59.69,20.32
N$156  (via drill 1 pad 1.78)
  other vias: 57.15,20.32
N$157  (via drill 1 pad 1.78)
  other vias: 54.61,20.32
N$158  (via drill 1 pad 1.78)
  other vias: 52.07,20.32
N$159  (via drill 1 pad 1.78)
  other vias: 49.53,20.32
N$160  (via drill 1 pad 1.78)
  other vias: 46.99,20.32
N$161  (via drill 1 pad 1.78)
  other vias: 44.45,20.32
N$165  (via drill 1 pad 1.78)
  other vias: 74.93,17.78
N$166  (via drill 1 pad 1.78)
  other vias: 72.39,17.78
N$167  (via drill 1 pad 1.78)
  other vias: 69.85,17.78
N$168  (via drill 1 pad 1.78)
  other vias: 67.31,17.78
N$169  (via drill 1 pad 1.78)
  other vias: 64.77,17.78
N$170  (via drill 1 pad 1.78)
  other vias: 62.23,17.78
N$171  (via drill 1 pad 1.78)
  other vias: 59.69,17.78
N$172  (via drill 1 pad 1.78)
  other vias: 57.15,17.78
N$173  (via drill 1 pad 1.78)
  other vias: 54.61,17.78
N$174  (via drill 1 pad 1.78)
  other vias: 52.07,17.78
N$175  (via drill 1 pad 1.78)
  other vias: 49.53,17.78
N$176  (via drill 1 pad 1.78)
  other vias: 46.99,17.78
N$177  (via drill 1 pad 1.78)
  other vias: 44.45,17.78
N$181  (via drill 1 pad 1.78)
  other vias: 74.93,15.24
N$182  (via drill 1 pad 1.78)
  other vias: 72.39,15.24
N$183  (via drill 1 pad 1.78)
  other vias: 69.85,15.24
N$184  (via drill 1 pad 1.78)
  other vias: 67.31,15.24
N$185  (via drill 1 pad 1.78)
  other vias: 64.77,15.24
N$186  (via drill 1 pad 1.78)
  other vias: 62.23,15.24
N$187  (via drill 1 pad 1.78)
  other vias: 59.69,15.24
N$188  (via drill 1 pad 1.78)
  other vias: 57.15,15.24
N$189  (via drill 1 pad 1.78)
  other vias: 54.61,15.24
N$190  (via drill 1 pad 1.78)
  other vias: 52.07,15.24
N$191  (via drill 1 pad 1.78)
  other vias: 49.53,15.24
N$192  (via drill 1 pad 1.78)
  other vias: 46.99,15.24
N$193  (via drill 1 pad 1.78)
  other vias: 44.45,15.24
N$197
  Top 0.61: AREF.1 ARDUINO.AREF
O-1
  Top 0.254: IC1.12 12.06,24.45 10.16,22.54 O1.1
O-2
  Top 0.254: IC1.9 12.06,36.51 10.79,37.78 O2.1
O-3
  Top 0.254: IC1.7 O3.1
O-4
  Top 0.254: IC1.5 O4.1
RST
  Top 0.254: RST.1 ARDUINO.RST
SCK  (via drill 0.3)
  Top 0.254: v14.61,27.3 IC1.14 | X5.5 20.53,15.35 v20.64,15.24
  Bottom 0.254: v14.61,27.3 14.61,17.78 17.14,15.24 v20.64,15.24

### Text on the board
Top: Rev 1.1 | TOP
Bottom: BOT
tPlace: Tx | Rx | Busy | ---SD--- | IRQ | CS | Detect | ---ADS--- | --- Analog --- | micro | SD
bPlace: open | hardware
tNames: mSD-Shield | 5V | 3V3 | GND | GND | 5V | 3V3 | GND | GND